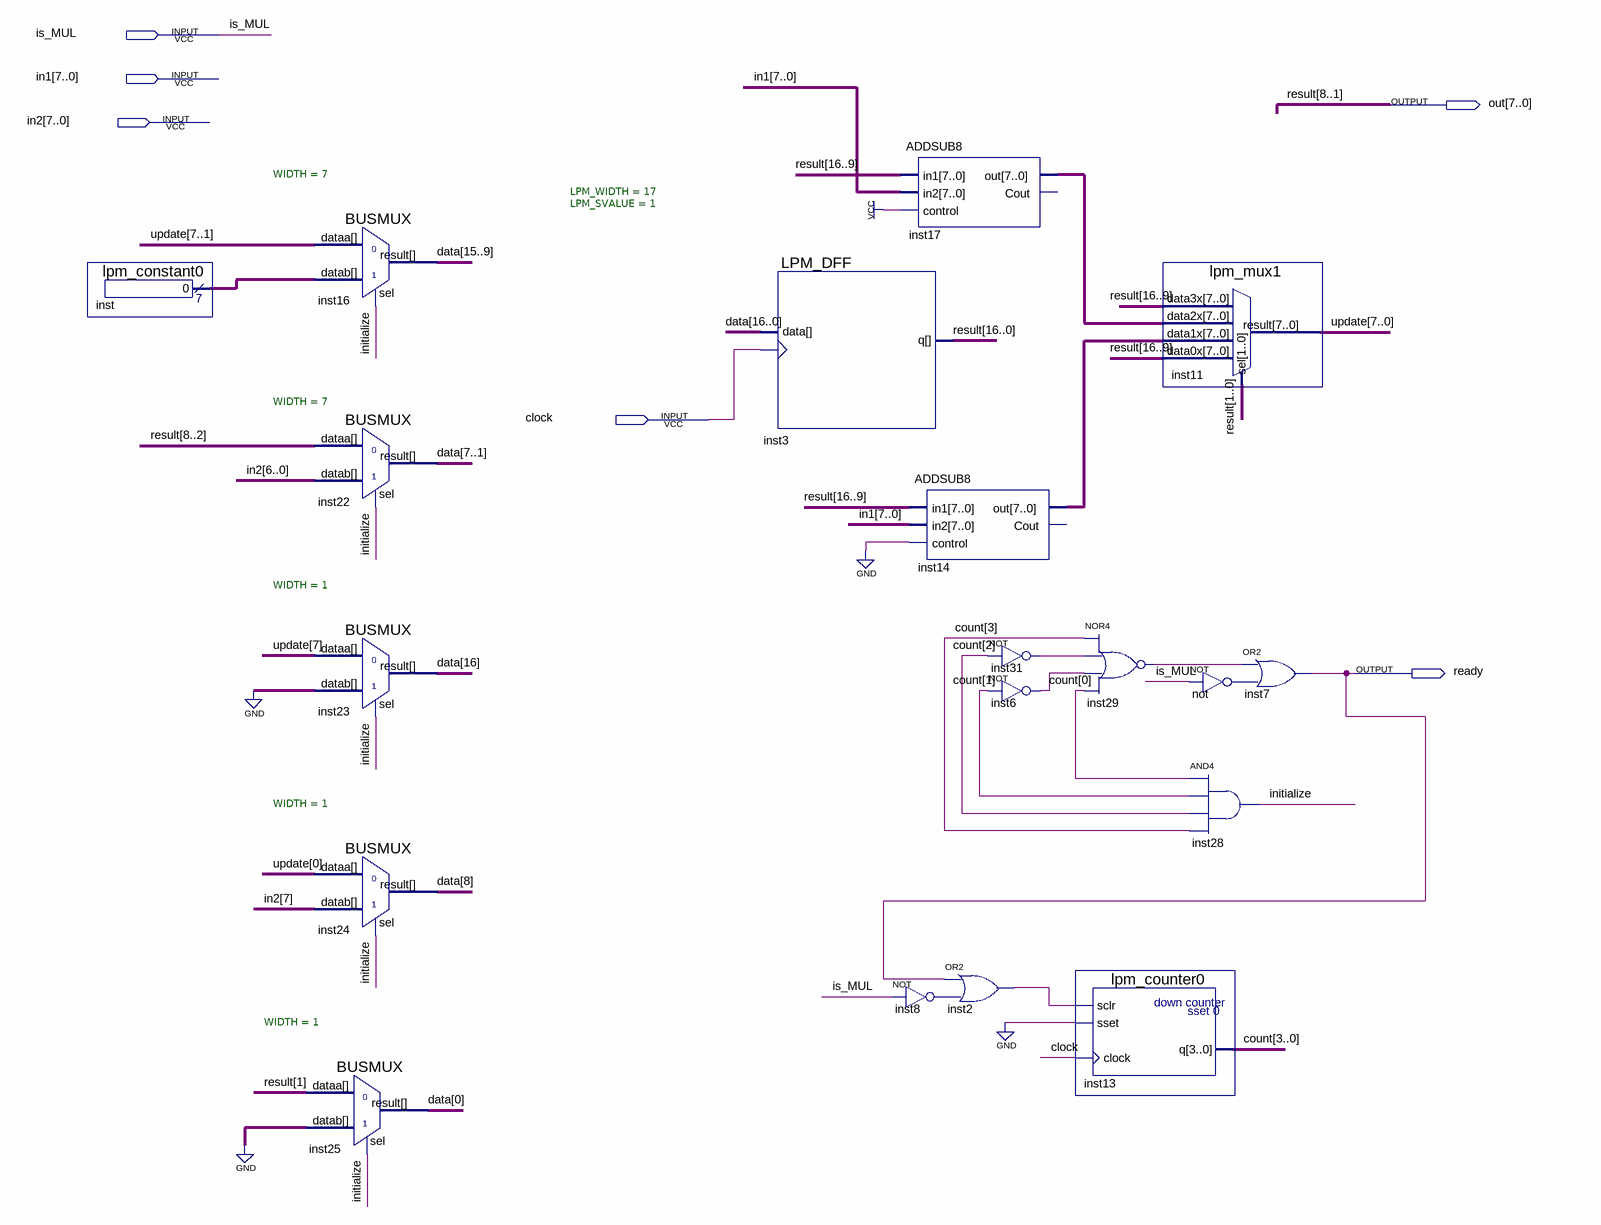
[diagram p0: schematic sheet]
// Quartus schematic MulByte.bdf as structural Verilog: 19 symbols, 6 pins
module MulByte (
  input  is_MUL,
  input  [7:0] in1,
  input  [7:0] in2,
  input  clock,
  output [7:0] out,
  output ready
);

  wire initialize, inst2_out, inst6_out, inst8_out, inst29_out, inst31_out, not_out;
  wire [3:0] count;
  wire [6:0] inst_result;
  wire [7:0] inst14_out, inst17_out, update;
  wire [16:0] data, result;

  lpm_constant0 inst (.result(inst_result));
  BUSMUX #(.WIDTH(7)) inst16 (.datab(inst_result), .sel(initialize), .dataa(update[7:1]), .result(data[15:9]));
  BUSMUX #(.WIDTH(7)) inst22 (.datab(in2[6:0]), .sel(initialize), .dataa(out[7:1]), .result(data[7:1]));
  BUSMUX #(.WIDTH(1)) inst23 (.datab(1'b0), .sel(initialize), .dataa(update[7]), .result(data[16]));
  BUSMUX #(.WIDTH(1)) inst24 (.datab(in2[7]), .sel(initialize), .dataa(update[0]), .result(data[8]));
  BUSMUX #(.WIDTH(1)) inst25 (.datab(1'b0), .sel(initialize), .dataa(out[0]), .result(data[0]));
  LPM_DFF #(.LPM_WIDTH(17), .LPM_SVALUE(1)) inst3 (.clock(clock), .data(data), .q({result[16:9], out, result[0]}));
  ADDSUB8 inst17 (.in1(result[16:9]), .in2(in1), .control(1'b1), .out(inst17_out));  // open: Cout
  ADDSUB8 inst14 (.in1(result[16:9]), .in2(in1), .control(1'b0), .out(inst14_out));  // open: Cout
  or inst2 (inst2_out, ready, inst8_out);
  not inst8 (inst8_out, is_MUL);
  not inst31 (inst31_out, count[2]);
  not inst6 (inst6_out, count[1]);
  nor inst29 (inst29_out, count[3], inst31_out, inst6_out, count[0]);
  lpm_counter0 inst13 (.sclr(inst2_out), .sset(1'b0), .clock(clock), .q(count));
  lpm_mux1 inst11 (
    .data3x(result[16:9]), .data2x(inst17_out), .data1x(inst14_out), .data0x(result[16:9]),
    .sel({out[0], result[0]}), .result(update));
  not \not  (not_out, is_MUL);
  and inst28 (initialize, count[0], count[1], count[2], count[3]);
  or inst7 (ready, inst29_out, not_out);

  // Other names for the same wires on the sheet: result[8:1] = out
endmodule
